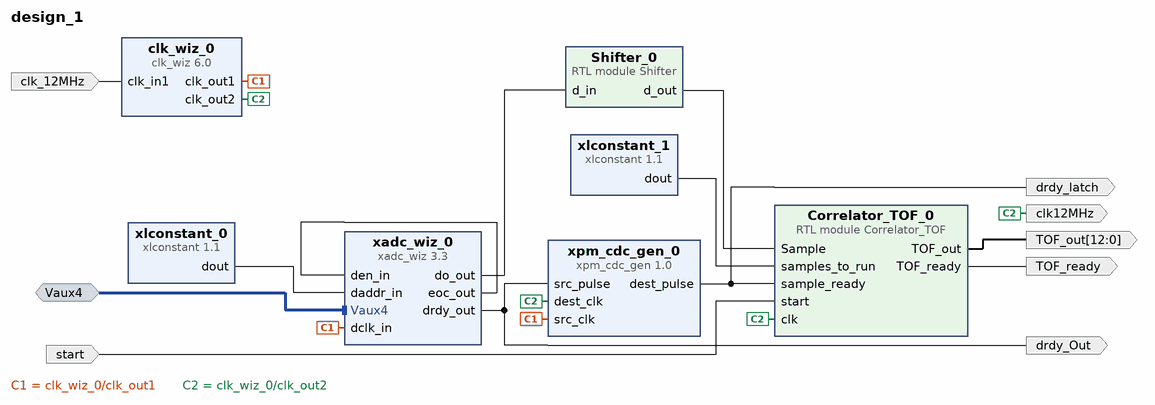
[diagram p0: block diagram of the top level]
# Vivado block design design_1, xc7a35tcpg236-1, Vivado 2024.1.2
create_bd_design design_1

create_bd_intf_port -mode Slave -vlnv xilinx.com:interface:diff_analog_io_rtl:1.0 Vaux4
create_bd_port -dir I -type clk clk_12MHz
set_property -dict {CONFIG.FREQ_HZ 12000000} [get_bd_ports clk_12MHz]
create_bd_port -dir I start
create_bd_port -dir O -from 12 -to 0 TOF_out
create_bd_port -dir O TOF_ready
create_bd_port -dir O drdy_latch
create_bd_port -dir O drdy_Out
create_bd_port -dir O clk12MHz

create_bd_cell -type ip -vlnv xilinx.com:ip:xadc_wiz:3.3 xadc_wiz_0
set_property -dict [list \
  CONFIG.ADC_CONVERSION_RATE 500 \
  CONFIG.ADC_OFFSET_AND_GAIN_CALIBRATION false \
  CONFIG.ENABLE_RESET false \
  CONFIG.INTERFACE_SELECTION ENABLE_DRP \
  CONFIG.OT_ALARM false \
  CONFIG.SENSOR_OFFSET_AND_GAIN_CALIBRATION false \
  CONFIG.SIM_FILE_NAME design3 \
  CONFIG.SINGLE_CHANNEL_SELECTION VAUXP4_VAUXN4 \
  CONFIG.STIMULUS_FREQ 1.0 \
  CONFIG.USER_TEMP_ALARM false \
  CONFIG.VCCAUX_ALARM false \
  CONFIG.VCCINT_ALARM false \
  CONFIG.WAVEFORM_TYPE SIN \
] [get_bd_cells xadc_wiz_0]
create_bd_cell -type module -reference Shifter Shifter_0
create_bd_cell -type ip -vlnv xilinx.com:ip:xlconstant:1.1 xlconstant_0
set_property -dict {CONFIG.CONST_VAL 20 CONFIG.CONST_WIDTH 7} [get_bd_cells xlconstant_0]
create_bd_cell -type ip -vlnv xilinx.com:ip:clk_wiz:6.0 clk_wiz_0
set_property -dict [list \
  CONFIG.CLKIN1_JITTER_PS 833.33 \
  CONFIG.CLKOUT1_JITTER 571.161 \
  CONFIG.CLKOUT1_PHASE_ERROR 613.025 \
  CONFIG.CLKOUT2_JITTER 861.078 \
  CONFIG.CLKOUT2_PHASE_ERROR 613.025 \
  CONFIG.CLKOUT2_REQUESTED_OUT_FREQ 12.000 \
  CONFIG.CLKOUT2_USED true \
  CONFIG.CLK_IN1_BOARD_INTERFACE sys_clock \
  CONFIG.MMCM_CLKFBOUT_MULT_F 50.000 \
  CONFIG.MMCM_CLKIN1_PERIOD 83.333 \
  CONFIG.MMCM_CLKIN2_PERIOD 10.0 \
  CONFIG.MMCM_CLKOUT0_DIVIDE_F 6.000 \
  CONFIG.MMCM_CLKOUT1_DIVIDE 50 \
  CONFIG.NUM_OUT_CLKS 2 \
  CONFIG.USE_LOCKED false \
  CONFIG.USE_RESET false \
] [get_bd_cells clk_wiz_0]
create_bd_cell -type module -reference Correlator_TOF Correlator_TOF_0
create_bd_cell -type ip -vlnv xilinx.com:ip:xlconstant:1.1 xlconstant_1
set_property -dict {CONFIG.CONST_VAL 7200 CONFIG.CONST_WIDTH 16} [get_bd_cells xlconstant_1]
create_bd_cell -type ip -vlnv xilinx.com:ip:xpm_cdc_gen:1.0 xpm_cdc_gen_0
set_property -dict [list \
  CONFIG.CDC_TYPE xpm_cdc_pulse \
  CONFIG.INIT_SYNC_FF true \
  CONFIG.RST_USED false \
  CONFIG.WIDTH 1 \
] [get_bd_cells xpm_cdc_gen_0]

# ---- connections ----

connect_bd_intf_net -intf_net Vaux4_1 [get_bd_intf_pins xadc_wiz_0/Vaux4] [get_bd_intf_ports Vaux4]
connect_bd_net [get_bd_pins Correlator_TOF_0/TOF_out] [get_bd_ports TOF_out]
connect_bd_net [get_bd_pins Correlator_TOF_0/TOF_ready] [get_bd_ports TOF_ready]
connect_bd_net [get_bd_pins Shifter_0/d_out] [get_bd_pins Correlator_TOF_0/Sample]
connect_bd_net -net SignalLatch_0_drdy_latch [get_bd_pins xpm_cdc_gen_0/dest_pulse] \
  [get_bd_ports drdy_latch] [get_bd_pins Correlator_TOF_0/sample_ready]
connect_bd_net [get_bd_ports clk_12MHz] [get_bd_pins clk_wiz_0/clk_in1]
connect_bd_net [get_bd_pins clk_wiz_0/clk_out1] [get_bd_pins xadc_wiz_0/dclk_in] [get_bd_pins xpm_cdc_gen_0/src_clk]
connect_bd_net [get_bd_pins clk_wiz_0/clk_out2] [get_bd_ports clk12MHz] [get_bd_pins xpm_cdc_gen_0/dest_clk] [get_bd_pins Correlator_TOF_0/clk]
connect_bd_net [get_bd_ports start] [get_bd_pins Correlator_TOF_0/start]
connect_bd_net [get_bd_pins xadc_wiz_0/do_out] [get_bd_pins Shifter_0/d_in]
connect_bd_net [get_bd_pins xadc_wiz_0/drdy_out] [get_bd_ports drdy_Out] [get_bd_pins xpm_cdc_gen_0/src_pulse]
connect_bd_net [get_bd_pins xadc_wiz_0/eoc_out] [get_bd_pins xadc_wiz_0/den_in]
connect_bd_net [get_bd_pins xlconstant_0/dout] [get_bd_pins xadc_wiz_0/daddr_in]
connect_bd_net [get_bd_pins xlconstant_1/dout] [get_bd_pins Correlator_TOF_0/samples_to_run]

validate_bd_design
save_bd_design
